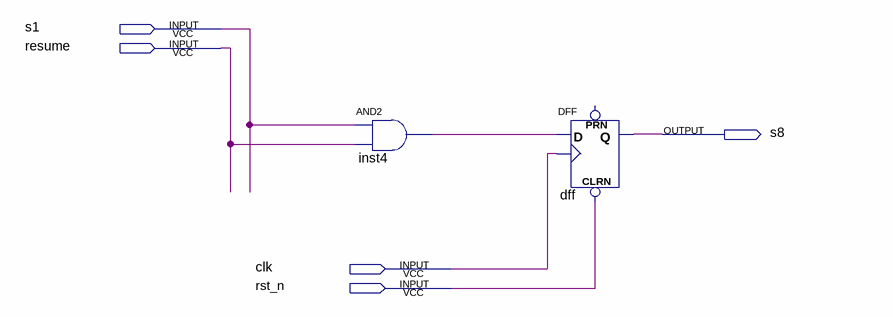
[diagram p0: schematic sheet]
// Quartus schematic s8.bdf as structural Verilog: 2 symbols, 5 pins
module s8 (
  input  s1,
  input  resume,
  input  clk,
  input  rst_n,
  output s8
);

  wire inst4_out;

  and inst4 (inst4_out, s1, resume);
  DFF dff (.CLRN(rst_n), .CLK(clk), .D(inst4_out), .Q(s8));  // open: PRN
endmodule
